# Altium schematic sheet Strain Gauge Peripherals.SchDoc
size Letter
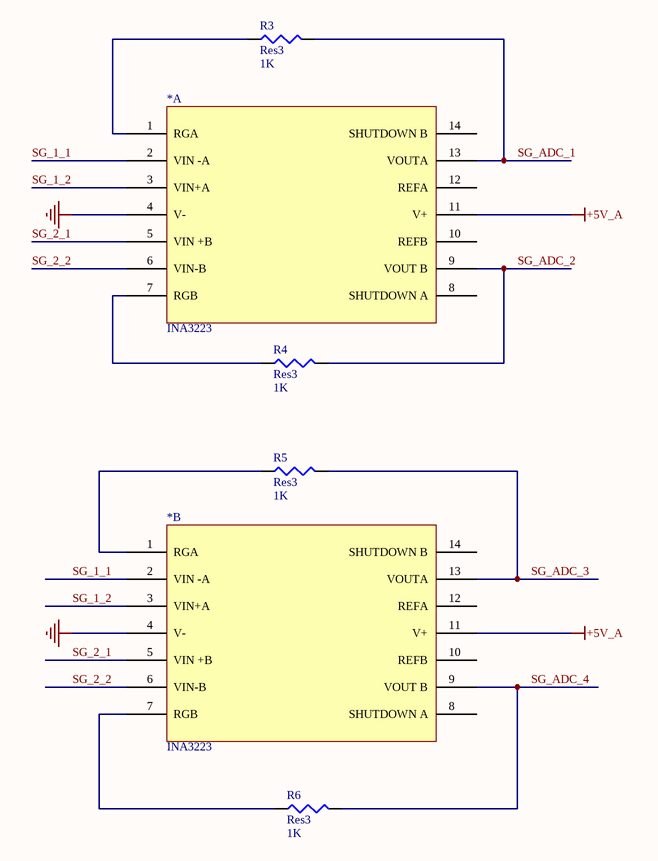
[diagram p0: Strain Gauge Peripherals.SchDoc]

## Parts
(Parts that share a designator on the sheet are numbered #1, #2 ... from top to bottom, then left to right.)
*#1  INA3223  (part A of 2)
*#2  INA3223  (part B of 2)
R3  Res3  value 1K  [J1-0603]
R4  Res3  value 1K  [J1-0603]
R5  Res3  value 1K  [J1-0603]
R6  Res3  value 1K  [J1-0603]

## Nets
+5V_A: *#1.11(V+) *#2.11(V+)
GND: *#1.4(V-) *#2.4(V-)
SG_1_1: *#1.2(VIN_-A) *#2.2(VIN_-A)
SG_1_2: *#1.3(VIN+A) *#2.3(VIN+A)
SG_2_1: *#1.5(VIN_+B) *#2.5(VIN_+B)
SG_2_2: *#1.6(VIN-B) *#2.6(VIN-B)
SG_ADC_1: *#1.13(VOUTA) R3.2
SG_ADC_2: *#1.9(VOUT_B) R4.2
SG_ADC_3: *#2.13(VOUTA) R5.2
SG_ADC_4: *#2.9(VOUT_B) R6.2
Net*#1_1: *#1.1(RGA) R3.1
Net*#1_7: *#1.7(RGB) R4.1
Net*#2_1: *#2.1(RGA) R5.1
Net*#2_7: *#2.7(RGB) R6.1

Not connected (* = marked no-connect by the designer): *#1 8(SHUTDOWN_A) 10(REFB) 12(REFA) 14(SHUTDOWN_B); *#2 8(SHUTDOWN_A) 10(REFB) 12(REFA) 14(SHUTDOWN_B)

## Notes on the sheet
- Date:
- Revision:
- Sheet:
- /

## Library data of the parts
R3-R6 = Res3: Resistor; Published: 8-Jun-2000; LatestRevisionDate: 29-May-2009; LatestRevisionNote: IPC-7351 Footprint Added.; PackageReference: J1-0603; Publisher: Altium Limited; PackageDescription: Chip Resistor